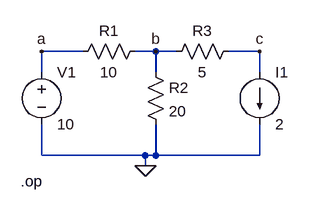
[diagram p0: schematic circuit1.asc]
circuit1.asc, the LTspice schematic file:
Version 4
SHEET 1 880 680
WIRE 64 128 0 128
WIRE 176 128 144 128
WIRE 208 128 176 128
WIRE 336 128 288 128
WIRE 0 160 0 128
WIRE 176 160 176 128
WIRE 336 160 336 128
WIRE 0 288 0 240
WIRE 160 288 0 288
WIRE 176 288 176 240
WIRE 176 288 160 288
WIRE 336 288 336 240
WIRE 336 288 176 288
WIRE 160 304 160 288
FLAG 176 128 b
FLAG 0 128 a
FLAG 336 128 c
FLAG 160 304 0
SYMBOL res 48 144 R270
WINDOW 0 32 56 VTop 2
WINDOW 3 0 56 VBottom 2
SYMATTR InstName R1
SYMATTR Value 10
SYMBOL res 160 144 R0
SYMATTR InstName R2
SYMATTR Value 20
SYMBOL voltage 0 144 R0
WINDOW 123 0 0 Left 0
WINDOW 39 0 0 Left 0
SYMATTR InstName V1
SYMATTR Value 10
SYMBOL res 192 144 R270
WINDOW 0 32 56 VTop 2
WINDOW 3 0 56 VBottom 2
SYMATTR InstName R3
SYMATTR Value 5
SYMBOL current 336 160 R0
SYMATTR InstName I1
SYMATTR Value 2
TEXT -32 328 Left 2 !.op

The netlist it stands for:
* circuit1.asc
R1 a b 10
R2 b 0 20
V1 a 0 10
R3 b c 5
I1 c 0 2
.op
.backanno
.end